# Altium project Smart Humidifier.PrjPcb
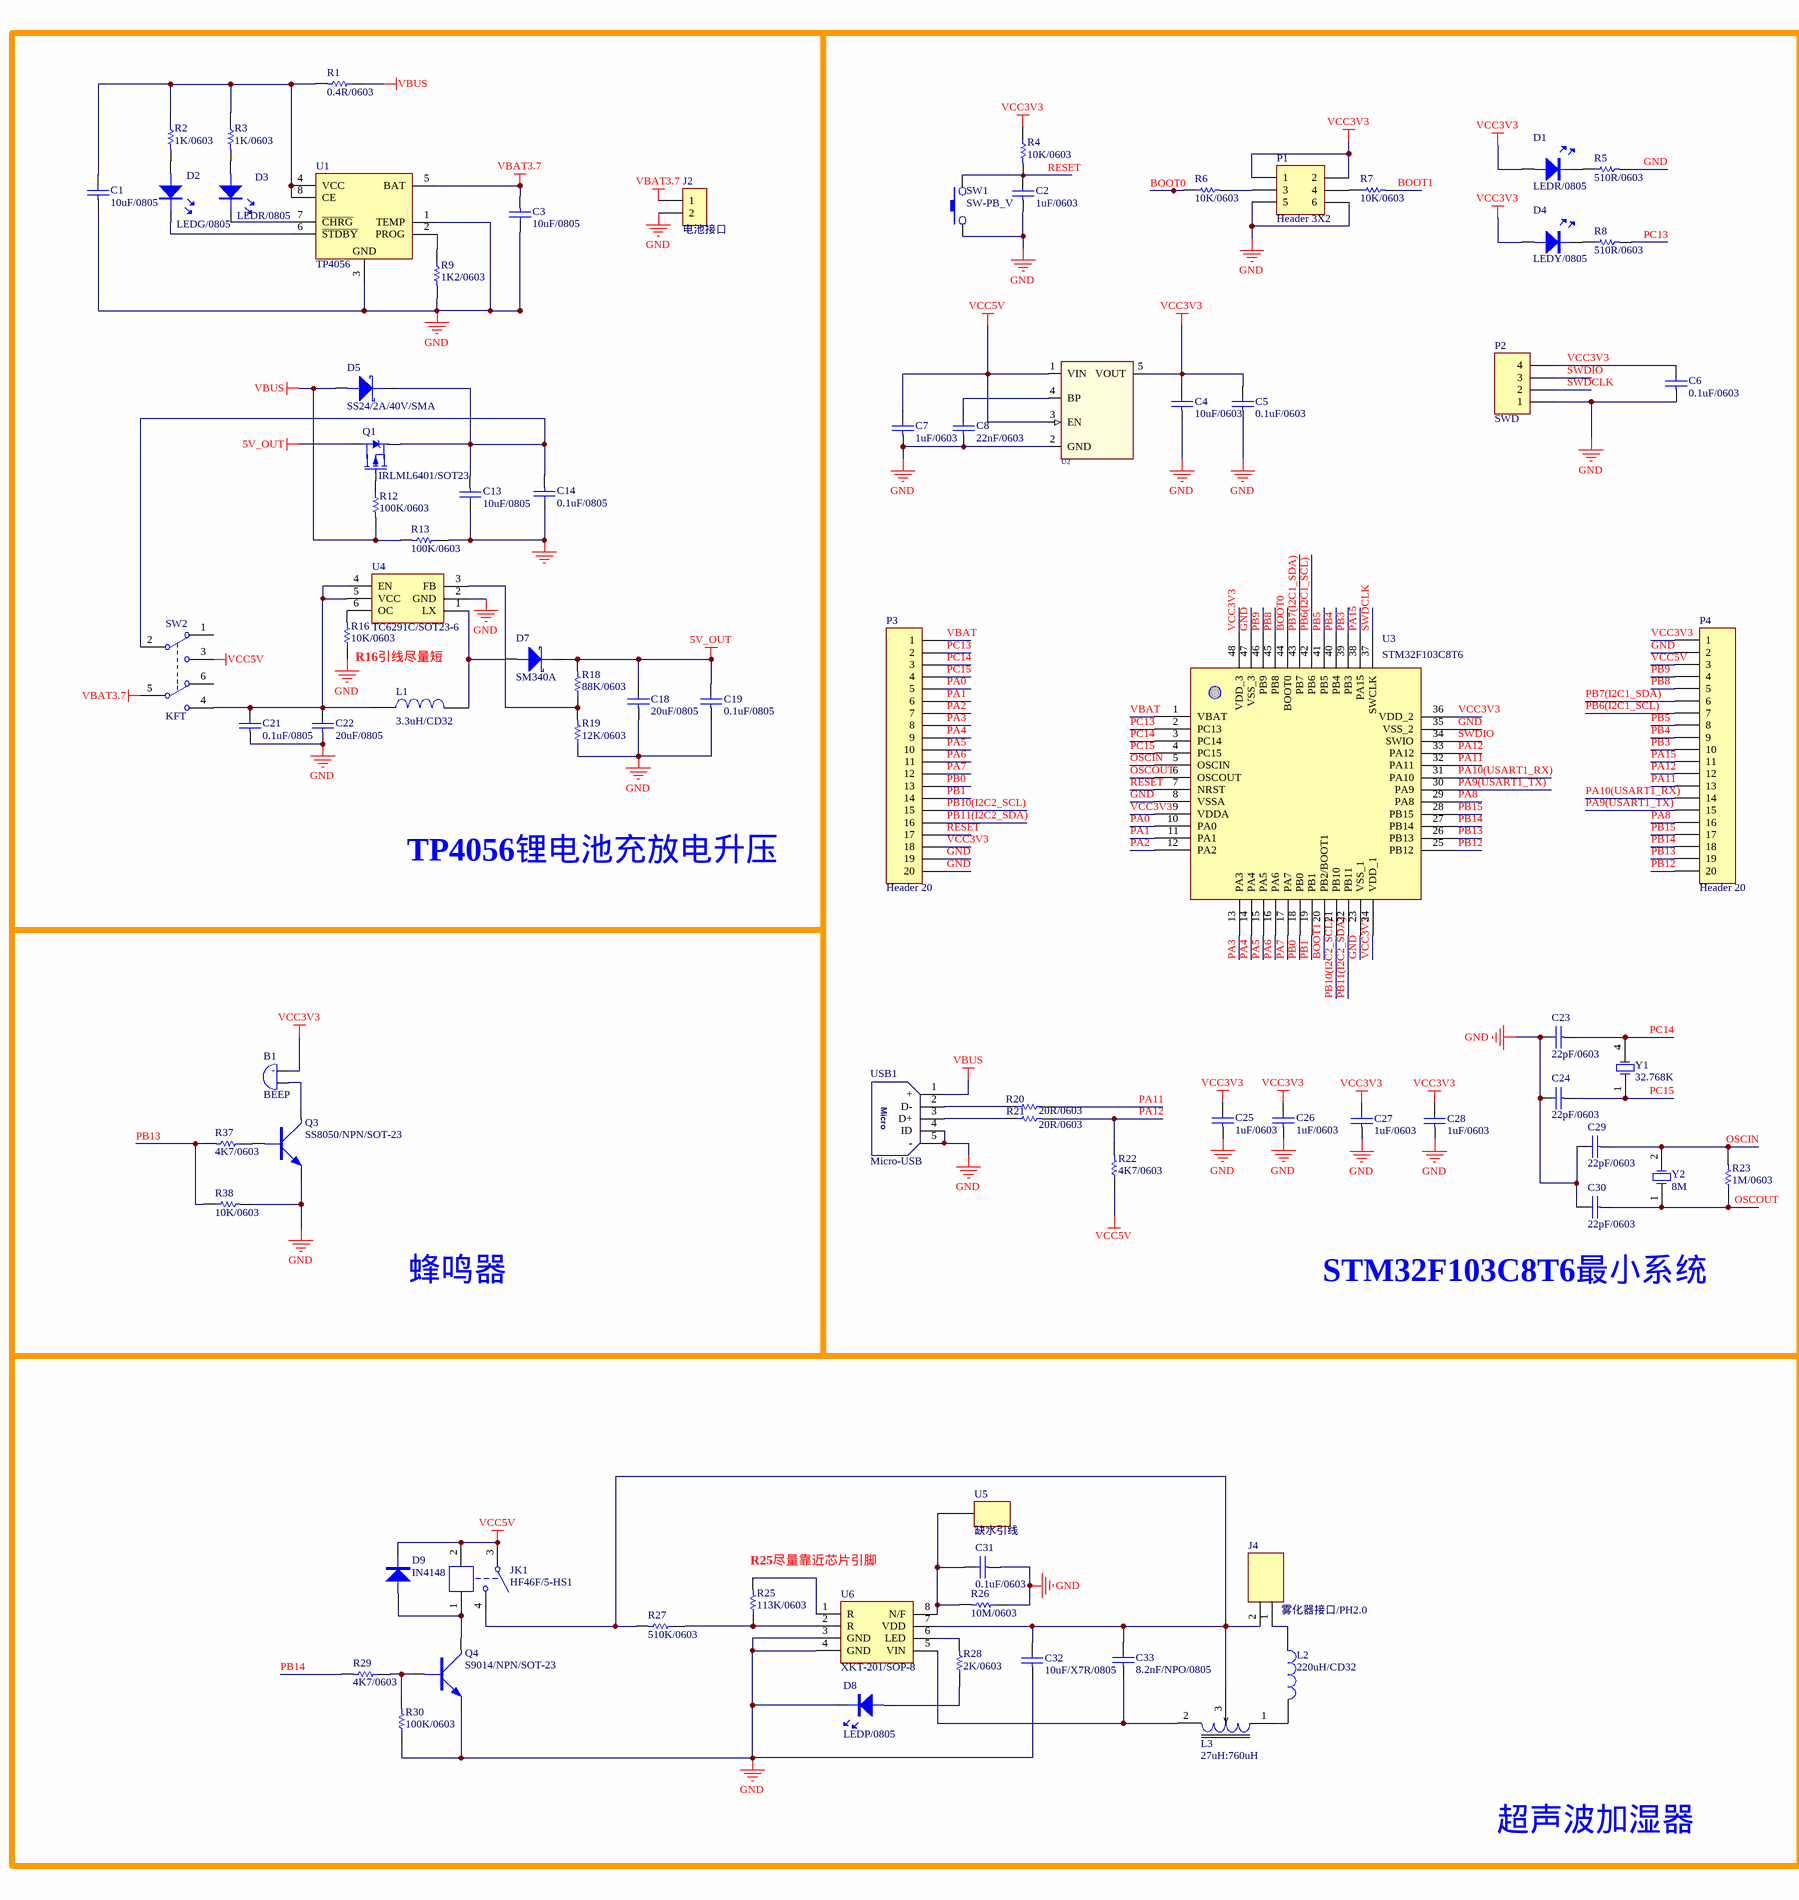
[diagram p0: Smart Humidifier.SchDoc, left]
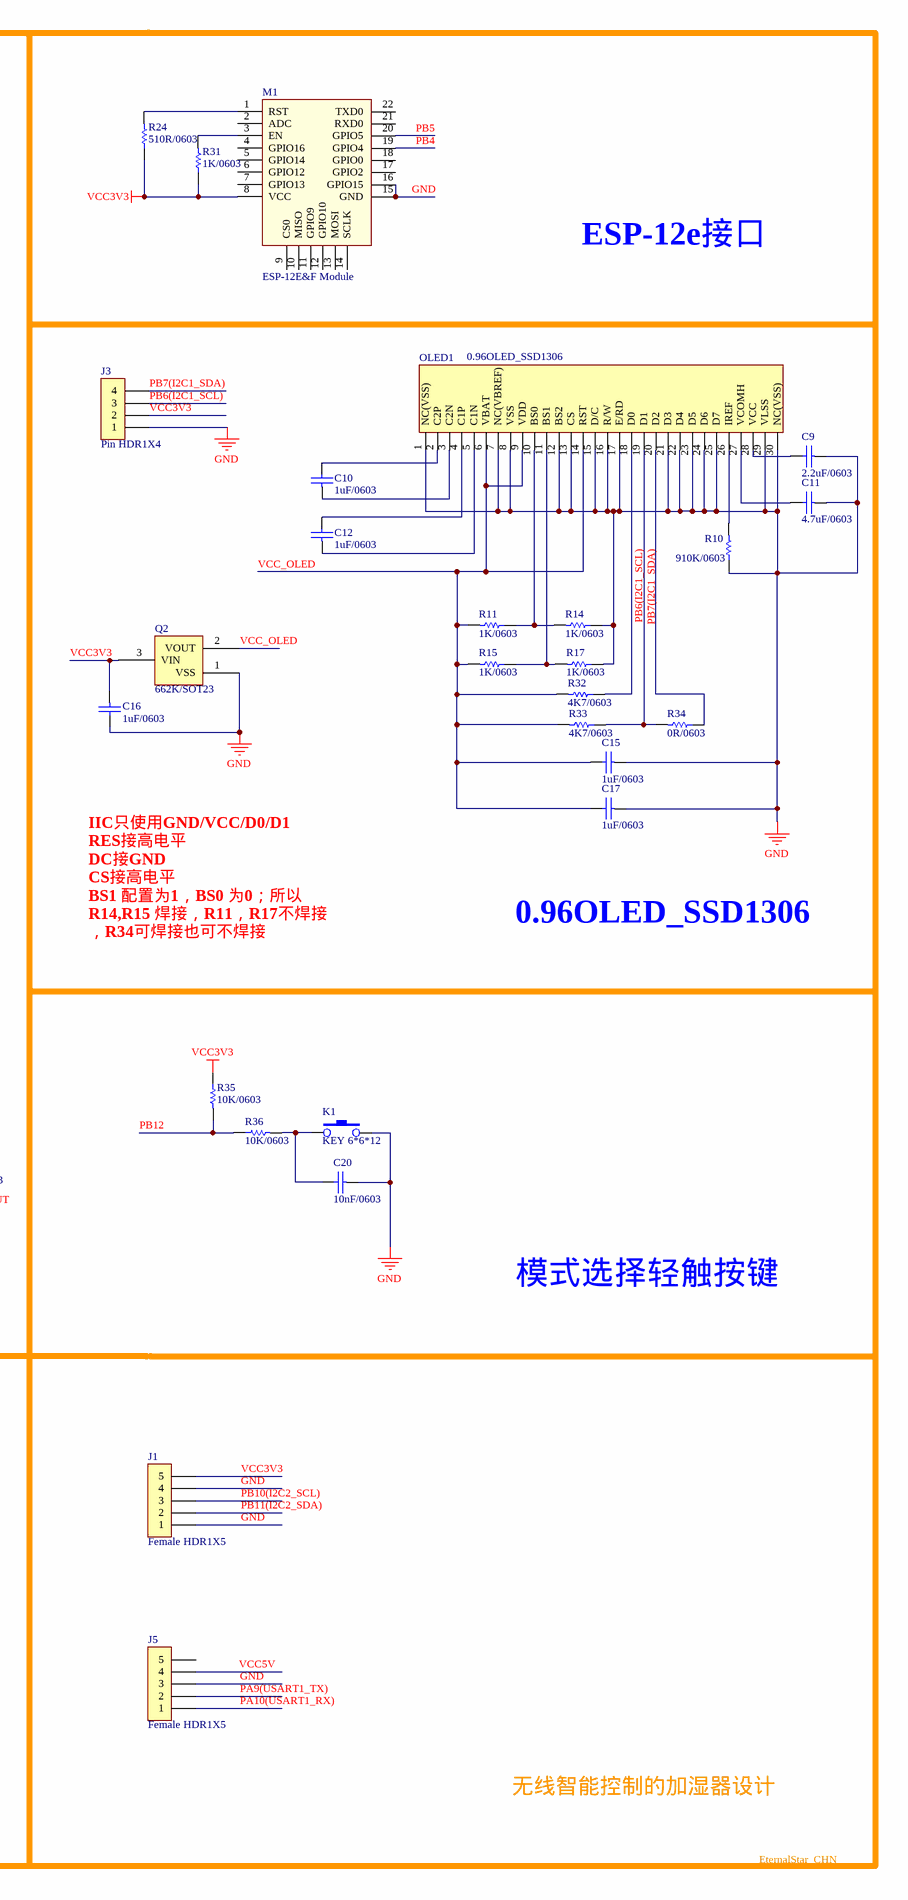
[diagram p1: Smart Humidifier.SchDoc, right]
1 sheet, 111 parts. Net scope: global (net labels, ports and power ports of the same name join across sheets).
Board file: Smart Humidifier.PcbDoc

## Sheet Smart Humidifier.SchDoc
size A2

### Parts
B1  BEEP  [BEEP 5x9x5.5]
C1  10uF/0805  [0805C]
C2  1uF/0603  [0603C]
C3  10uF/0805  [0805C]
C4  10uF/0603  [0603C]
C5  0.1uF/0603  [0603C]
C6  0.1uF/0603  [0603C]
C7  1uF/0603  [0603C]
C8  22nF/0603  [0603C]
C9  2.2uF/0603  [0603C]
C10  1uF/0603  [0603C]
C11  4.7uF/0603  [0603C]
C12  1uF/0603  [0603C]
C13  10uF/0805  [0805C]
C14  0.1uF/0805  [0805C]
C15  1uF/0603  [0603C]
C16  1uF/0603  [0603C]
C17  1uF/0603  [0603C]
C18  20uF/0805  [0805C]
C19  0.1uF/0805  [0805C]
C20  10nF/0603  [0805C]
C21  0.1uF/0805  [0805C]
C22  20uF/0805  [0805C]
C23  22pF/0603  [0603C]
C24  22pF/0603  [0603C]
C25  1uF/0603  [0603C]
C26  1uF/0603  [0603C]
C27  1uF/0603  [0603C]
C28  1uF/0603  [0603C]
C29  22pF/0603  [0603C]
C30  22pF/0603  [0603C]
C31  0.1uF/0603  [0603C]
C32  10uF/X7R/0805  [0805C]
C33  8.2nF/NPO/0805  [0805C]
D1  LEDR/0805  [LED-0805R]
D2  LEDG/0805  [LED-0805G]
D3  LEDR/0805  [LED-0805R]
D4  LEDY/0805  [LED-0805Y]
D5  SS24/2A/40V/SMA  [SMA/DO-214AC]
D7  SM340A  [SMA/DO-214AC]
D8  LEDP/0805  [LED-0805Y]
D9  IN4148  [SOD-523]
J1  Female HDR1X5  [Fe-HDR1X5/2.54-S]
J2  电池接口  [Fe-HDR1X2/2.54-S]
J3  Pin HDR1X4  [Pin HDR1X4/2.54mm-S]
J4  雾化器接口/PH2.0  [PH2.0-2P]
J5  Female HDR1X5  [Fe-HDR1X5/2.54-S]
JK1  HF46F/5-HS1  [HF46-xx-HS1]
K1  KEY 6*6*12  [DIP-6X6X12_C]
L1  3.3uH/CD32  [CD32]
L2  220uH/CD32  [CD32]
L3  27uH:760uH  [INDUCTOR Tripod]
M1  ESP-12E&F Module  [ESP-12E&F Module]
OLED1  0.96OLED_SSD1306  [OLED_0.96]
P1  Header 3X2  [HDR-3X2]
P2  SWD  [HDR-1X4_H]
P3  Header 20  [HDR1X20]
P4  Header 20  [HDR1X20]
Q1  IRLML6401/SOT23  [SOT23]
Q2  662K/SOT23  [SOT23]
Q3  SS8050/NPN/SOT-23  [SOT-23]
Q4  S9014/NPN/SOT-23  [SOT-23]
R1  0.4R/0603  [0603R]
R2  1K/0603  [0603R]
R3  1K/0603  [0603R]
R4  10K/0603  [0603R]
R5  510R/0603  [0603R]
R6  10K/0603  [0603R]
R7  10K/0603  [0603R]
R8  510R/0603  [0603R]
R9  1K2/0603  [0603R]
R10  910K/0603  [0603R]
R11  1K/0603  [0603R]
R12  100K/0603  [0603R]
R13  100K/0603  [0603R]
R14  1K/0603  [0603R]
R15  1K/0603  [0603R]
R16  10K/0603  [0603R]
R17  1K/0603  [0603R]
R18  88K/0603  [0603R]
R19  12K/0603  [0603R]
R20  20R/0603  [0603R]
R21  20R/0603  [0603R]
R22  4K7/0603  [0603R]
R23  1M/0603  [0603R]
R24  510R/0603  [0603R]
R25  113K/0603  [0603R]
R26  10M/0603  [0603R]
R27  510K/0603  [0603R]
R28  2K/0603  [0603R]
R29  4K7/0603  [0603R]
R30  100K/0603  [0603R]
R31  1K/0603  [0603R]
R32  4K7/0603  [0603R]
R33  4K7/0603  [0603R]
R34  0R/0603  [0603R]
R35  10K/0603  [0603R]
R36  10K/0603  [0603R]
R37  4K7/0603  [0603R]
R38  10K/0603  [0603R]
SW1  SW-PB_V  [TSW SMD-3*6*2.5]
SW2  KFT  [KFT DIP-7X7]
U1  TP4056  [SOP8]
U2  RT9193  [SOT23-5L]  (value not drawn)
U3  STM32F103C8T6  [TQFP48 7x7_L]
U4  TC6291C/SOT23-6  [SOT23-6]
U5  缺水引线  [通孔焊盘]
U6  XKT-201/SOP-8  [SOP8]
USB1  Micro-USB  [USB-micro_B]
Y1  32.768K  [MC-306]
Y2  8M  [XTAL-49S DIP]

### Nets
5V_OUT: C18.2 C19.2 D7.K Q1.D R18.2
GND: C1.1 C2.1 C3.2 C4.1 C5.1 C6.1 C7.1 C8.1 C9.1 C11.1 C13.2 C14.2 C15.1 C16.2 C17.1 C18.1 C19.1 C20.1 C21.1 C22.1 C23.2 C24.2 C25.1 C26.1 C27.1 C28.1 C29.2 C30.2 C31.2 C32.1 D8.K J1.1 J1.4 J2.2 J3.1 J5.3 K1.3 M1.15(GND) M1.16(GPIO15) OLED1.1(NC(VSS)) OLED1.7(NC(VBREF)) OLED1.8(VSS) OLED1.12(BS2) OLED1.13(CS) OLED1.15(D/C) OLED1.16(R/W) OLED1.17(E/RD) OLED1.21(D3) OLED1.22(D4) OLED1.23(D5) OLED1.24(D6) OLED1.25(D7) OLED1.29(VLSS) OLED1.30(NC(VSS)) P1.5 P1.6 P2.1 P3.19 P3.20 P4.2 Q2.1(VSS) Q3.E Q4.E R5.2 R9.2 R10.1 R13.1 R14.1 R16.1 R17.1 R19.1 R26.1 R30.1 R38.2 SW1.1 U1.1(TEMP) U1.3(GND) U2.2(GND) U3.8(VSSA) U3.23(VSS_1) U3.35(VSS_2) U3.47(VSS_3) U4.2(GND) U6.3(GND) U6.4(GND) USB1.4(ID) USB1.5(-)
VBAT3.7: C3.1 J2.1 SW2.5(COM2) U1.5(BAT)
VBUS: D5.A R1.1 R12.2 R13.2 USB1.1(+)
VCC3V3: B1.1 C4.2 C5.2 C6.2 C16.1 C25.2 C26.2 C27.2 C28.2 D1.A D4.A J1.5 J3.2 M1.8(VCC) P1.1 P1.2 P2.4 P3.18 P4.1 Q2.3(VIN) R4.1 R24.1 R31.1 R35.1 U2.5(VOUT) U3.9(VDDA) U3.24(VDD_1) U3.36(VDD_2) U3.48(VDD_3)
VCC5V: C7.2 D9.K J5.4 JK1.2 JK1.3 P4.3 R22.1 SW2.3(NO1) U2.1(VIN) U2.3(EN)
BOOT0: R6.1 U3.44(BOOT0)
BOOT1: R7.2 U3.20(PB2/BOOT1)
OSCIN: C29.1 R23.2 U3.5(OSCIN) Y2.2(OSC2)
OSCOUT: C30.1 R23.1 U3.6(OSCOUT) Y2.1(OSC1)
PA0: P3.5 U3.10(PA0)
PA1: P3.6 U3.11(PA1)
PA2: P3.7 U3.12(PA2)
PA3: P3.8 U3.13(PA3)
PA4: P3.9 U3.14(PA4)
PA5: P3.10 U3.15(PA5)
PA6: P3.11 U3.16(PA6)
PA7: P3.12 U3.17(PA7)
PA8: P4.16 U3.29(PA8)
PA9(USART1_TX): J5.2 P4.15 U3.30(PA9)
PA10(USART1_RX): J5.1 P4.14 U3.31(PA10)
PA11: P4.13 R20.2 U3.32(PA11)
PA12: P4.12 R21.2 R22.2 U3.33(PA12)
PA15: P4.11 U3.38(PA15)
PB0: P3.13 U3.18(PB0)
PB1: P3.14 U3.19(PB1)
PB3: P4.10 U3.39(PB3)
PB4: M1.19(GPIO4) P4.9 U3.40(PB4)
PB5: M1.20(GPIO5) P4.8 U3.41(PB5)
PB6(I2C1_SCL): J3.3 OLED1.18(D0) P4.7 R32.1 U3.42(PB6)
PB7(I2C1_SDA): J3.4 OLED1.19(D1) P4.6 R33.1 R34.2 U3.43(PB7)
PB8: P4.5 U3.45(PB8)
PB9: P4.4 U3.46(PB9)
PB10(I2C2_SCL): J1.3 P3.15 U3.21(PB10)
PB11(I2C2_SDA): J1.2 P3.16 U3.22(PB11)
PB12: P4.20 R35.2 R36.1 U3.25(PB12)
PB13: P4.19 R37.2 R38.1 U3.26(PB13)
PB14: P4.18 R29.2 U3.27(PB14)
PB15: P4.17 U3.28(PB15)
PC13: P3.2 R8.2 U3.2(PC13)
PC14: C23.1 P3.3 U3.3(PC14) Y1.4(OSC2)
PC15: C24.1 P3.4 U3.4(PC15) Y1.1(OSC1)
RESET: C2.2 P3.17 R4.2 SW1.2 U3.7(NRST)
SWDCLK: P2.2 U3.37(SWCLK)
SWDIO: P2.3 U3.34(SWIO)
VBAT: P3.1 U3.1(VBAT)
VCC_OLED: C15.2 C17.2 OLED1.6(VBAT) OLED1.9(VDD) OLED1.14(RST) Q2.2(VOUT) R11.2 R15.2 R32.2 R33.2
NetB1_2: B1.2 Q3.C
NetC1_2: C1.2 R1.2 R2.1 R3.1 U1.4(VCC) U1.8(CE)
NetC8_2: C8.2 U2.4(BP)
NetC9_2: C9.2 OLED1.28(VCC)
NetC10_1: C10.1 OLED1.3(C2N)
NetC10_2: C10.2 OLED1.2(C2P)
NetC11_2: C11.2 OLED1.27(VCOMH)
NetC12_1: C12.1 OLED1.5(C1N)
NetC12_2: C12.2 OLED1.4(C1P)
NetC13_1: C13.1 C14.1 D5.K Q1.S SW2.2(COM2)
NetC20_2: C20.2 K1.1 R36.2
NetC21_2: C21.2 C22.2 L1.1 SW2.4(NO2) U4.4(EN) U4.5(VCC)
NetC31_1: C31.1 R26.2 U5.Hole(Con) U6.8(N/F)
NetC32_2: C32.2 C33.2 J4.2 JK1.4 L3.3 R27.2 U6.7(VDD)
NetC33_1: C33.1 L3.2 U6.5(VIN)
NetD1_K: D1.K R5.1
NetD2_A: D2.A R2.2
NetD2_K: D2.K U1.6(~{STDBY})
NetD3_A: D3.A R3.2
NetD3_K: D3.K U1.7(~{CHRG})
NetD4_K: D4.K R8.1
NetD7_A: D7.A L1.2 U4.1(LX)
NetD8_A: D8.A R28.1
NetD9_A: D9.A JK1.1 Q4.C
NetJ4_1: J4.1 L2.1
NetL2_2: L2.2 L3.1
NetM1_1: M1.1(RST) R24.2
NetM1_3: M1.3(EN) R31.2
NetOLED1_10: OLED1.10(BS0) R11.1 R14.2
NetOLED1_11: OLED1.11(BS1) R15.1 R17.2
NetOLED1_20: OLED1.20(D2) R34.1
NetOLED1_26: OLED1.26(IREF) R10.2
NetP1_3: P1.3 R6.2
NetP1_4: P1.4 R7.1
NetQ1_G: Q1.G R12.1
NetQ3_B: Q3.B R37.1
NetQ4_B: Q4.B R29.1 R30.2
NetR9_1: R9.1 U1.2(PROG)
NetR16_2: R16.2 U4.6(OC)
NetR18_1: R18.1 R19.2 U4.3(FB)
NetR20_1: R20.1 USB1.2(D-)
NetR21_1: R21.1 USB1.3(D+)
NetR25_1: R25.1 R27.1 U6.2(R)
NetR25_2: R25.2 U6.1(R)
NetR28_2: R28.2 U6.6(LED)

Not connected (* = marked no-connect by the designer): J5 5; M1 2(ADC) 4(GPIO16) 5(GPIO14) 6(GPIO12) 7(GPIO13) 9(CS0) 10(MISO) 11(GPIO9) 12(GPIO10) 13(MOSI) 14(SCLK) 17(GPIO2) 18(GPIO0) 21(RXD0) 22(TXD0); SW2 1(NC1) 6(NC2)

### Notes on the sheet
- ESP-12e接口
- (near R16) R16引线尽量短
- TP4056锂电池充放电升压
- IIC只使用GND/VCC/D0/D1
  RES接高电平
  DC接GND
  CS接高电平
  BS1 配置为1，BS0 为0；所以R14,R15 焊接，R11，R17不焊接，R34可焊接也可不焊接
- 0.96OLED_SSD1306
- 蜂鸣器
- (near C30) STM32F103C8T6最小系统
- 模式选择轻触按键
- (near R25) R25尽量靠近芯片引脚
- 无线智能控制的加湿器设计
- 超声波加湿器
- EternalStar_CHN
- (in symbol BEEP) +
- (in symbol Micro-USB) Micro

### Library data of the parts
B1 = BEEP: 蜂鸣器
C1-C33 = CAP: 无极性电容
D1-D4 D8 = LED
D5 D7 = DIODE SCHOTTKY: 肖特基二极管
D9 = DIODE: 普通二极管
J2 = Female HDR1X2
J4 = PH2.0-2P
JK1 = HF46F/5-HS1: 5V一组常开; BOM名称: 5V继电器; 版权归属: 源创客; 学习资源: www.ooocke.com
K1 = KEY
L1 L2 = INDUCTOR
L3 = INDUCTOR Tripod: 三脚工字形电感线圈直插式
P1 = Header 3X2: Header, 3-Pin, Dual row; LatestRevisionDate: 17-Jul-2002; LatestRevisionNote: Re-released for DXP Platform.; Publisher: Altium Limited
P2 = Header 4: Header, 4-Pin; LatestRevisionDate: 17-Jul-2002; LatestRevisionNote: Re-released for DXP Platform.; Publisher: Altium Limited
P3 P4 = Header 20: Header, 20-Pin; LatestRevisionDate: 17-Jul-2002; LatestRevisionNote: Re-released for DXP Platform.; Publisher: Altium Limited
Q1 = P-MOS: P沟道场效应管
Q2 = LDO_SOT23: SOT23封装LDO
Q3 Q4 = NPN: NPN三极管
R1-R38 = RES
SW1 = SW-PB_V: SWITCH
SW2 = KFT_7X7-DIP: Self-locking Switch
U2 = RT9193X_5P: ICA_MFR_NAME: RICHTEK; ICA_PARTNUM: $$2191094$$RT9193-15CU5; Part Number: TMP-13
U4 = TC6291C: DC-DC升压IC
U5 = 过孔焊盘
U6 = XKT-201: 5V加湿器驱动芯片
Y1 Y2 = XTAL: Crystal Oscillator; Published: 8-Jun-2000; LatestRevisionDate: 17-Jul-2002; LatestRevisionNote: Re-released for DXP Platform.; Publisher: Altium Limited